# Altium schematic sheet LTC2194_3.SchDoc
size A; SheetNumber: 8; SheetTotal: 24
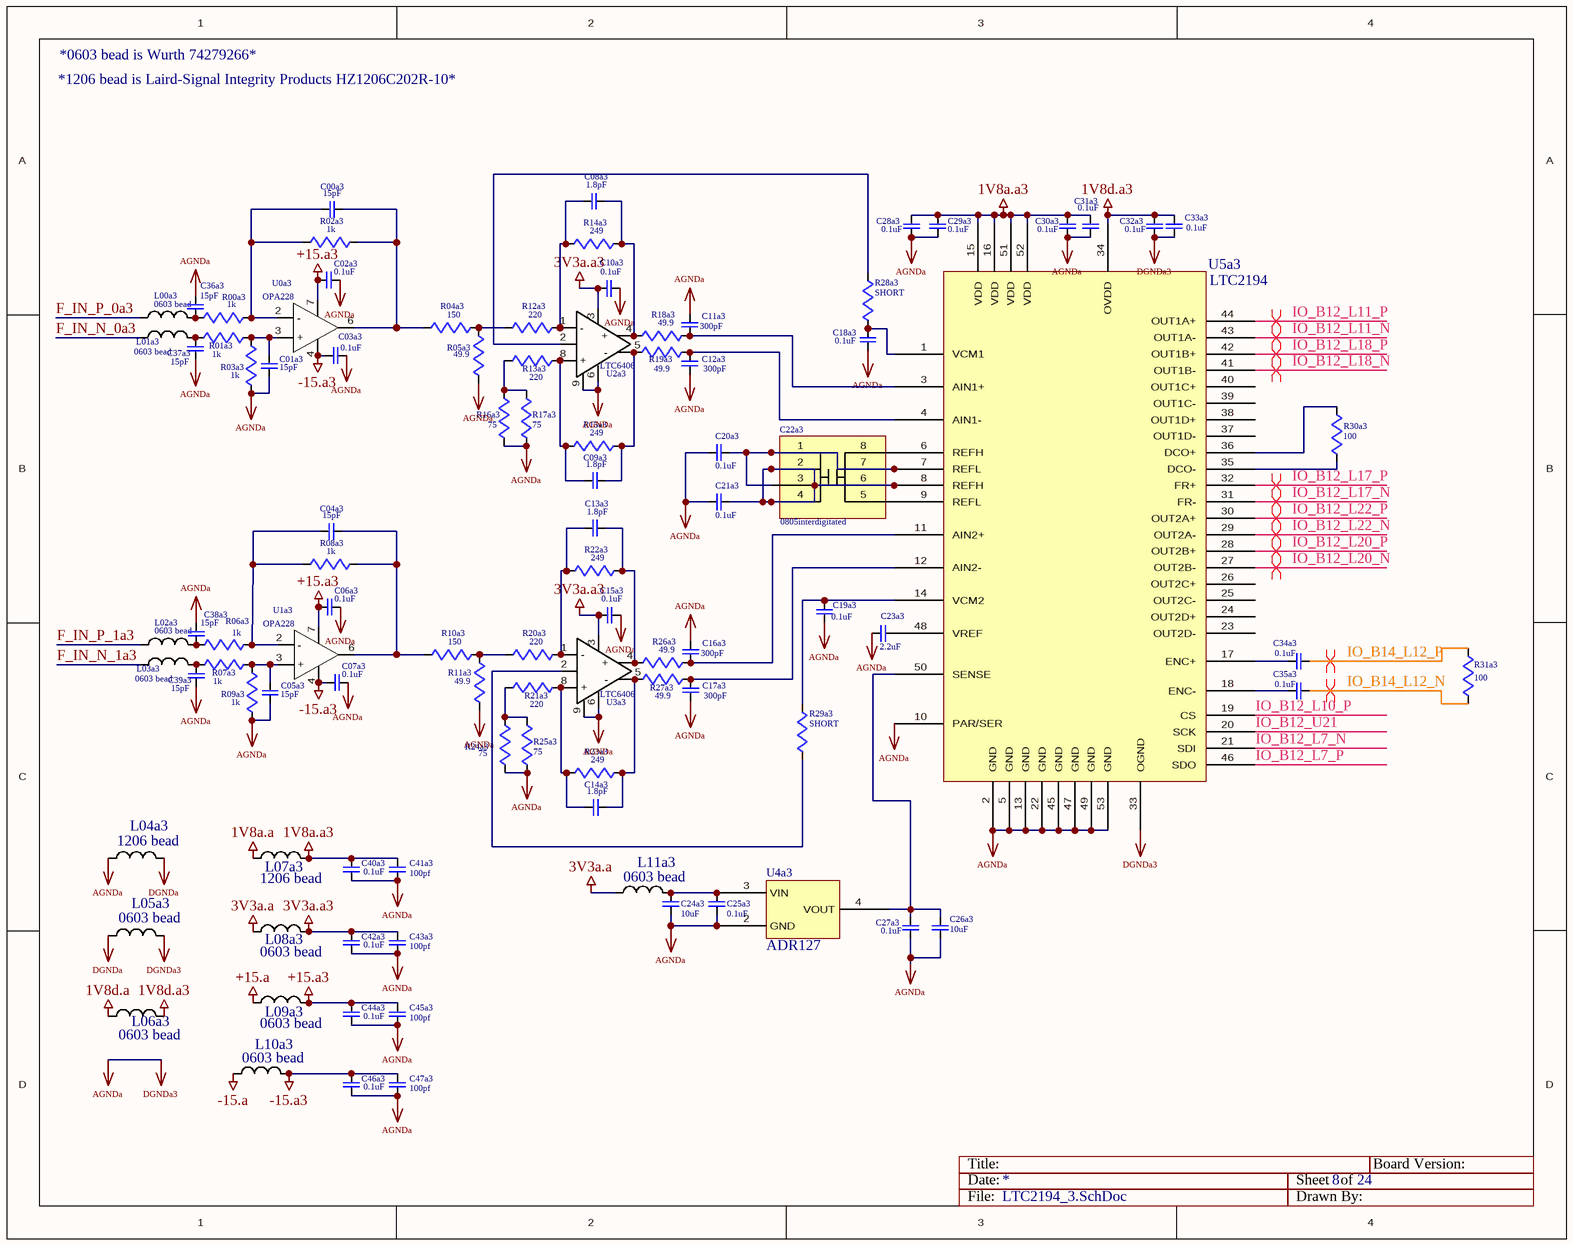
[diagram p0: LTC2194_3.SchDoc]

## Parts
C00a3  15pF  [0603]
C01a3  15pF  [0603]
C02a3  0.1uF  [0603]
C03a3  0.1uF  [0603]
C04a3  15pF  [0603]
C05a3  15pF  [0603]
C06a3  0.1uF  [0603]
C07a3  0.1uF  [0603]
C08a3  1.8pF  [0603]
C09a3  1.8pF  [0603]
C10a3  0.1uF  [0603]
C11a3  300pF  [0603]
C12a3  300pF  [0603]
C13a3  1.8pF  [0603]
C14a3  1.8pF  [0603]
C15a3  0.1uF  [0603]
C16a3  300pF  [0603]
C17a3  300pF  [0603]
C18a3  0.1uF  [0402]
C19a3  0.1uF  [0402]
C20a3  0.1uF  [0402]
C21a3  0.1uF  [0402]
C22a3  0805interdigitated  [0805int]
C23a3  2.2uF  [0402]
C24a3  10uF  [0603]
C25a3  0.1uF  [0603]
C26a3  10uF  [0603]
C27a3  0.1uF  [0603]
C28a3  0.1uF  [0402]
C29a3  0.1uF  [0402]
C30a3  0.1uF  [0402]
C31a3  0.1uF  [0402]
C32a3  0.1uF  [0402]
C33a3  0.1uF  [0402]
C34a3  0.1uF  [0402]
C35a3  0.1uF  [0402]
C36a3  15pF  [0603]
C37a3  15pF  [0603]
C38a3  15pF  [0603]
C39a3  15pF  [0603]
C40a3  0.1uF  [0603]
C41a3  100pf  [0603]
C42a3  0.1uF  [0603]
C43a3  100pf  [0603]
C44a3  0.1uF  [0603]
C45a3  100pf  [0603]
C46a3  0.1uF  [0603]
C47a3  100pf  [0603]
L00a3  0603 bead  [0603]
L01a3  0603 bead  [0603]
L02a3  0603 bead  [0603]
L03a3  0603 bead  [0603]
L04a3  1206 bead  [1206]
L05a3  0603 bead  [0603]
L06a3  0603 bead  [0603]
L07a3  1206 bead  [1206]
L08a3  0603 bead  [0603]
L09a3  0603 bead  [0603]
L10a3  0603 bead  [0603]
L11a3  0603 bead  [0603]
R00a3  1k  [0603]
R01a3  1k  [0603]
R02a3  1k  [0603]
R03a3  1k  [0603]
R04a3  150  [0603]
R05a3  49.9  [0603]
R06a3  1k  [0603]
R07a3  1k  [0603]
R08a3  1k  [0603]
R09a3  1k  [0603]
R10a3  150  [0603]
R11a3  49.9  [0603]
R12a3  220  [0603]
R13a3  220  [0603]
R14a3  249  [0603]
R15a3  249  [0603]
R16a3  75  [0603]
R17a3  75  [0603]
R18a3  49.9  [0603]
R19a3  49.9  [0603]
R20a3  220  [0603]
R21a3  220  [0603]
R22a3  249  [0603]
R23a3  249  [0603]
R24a3  75  [0603]
R25a3  75  [0603]
R26a3  49.9  [0603]
R27a3  49.9  [0603]
R28a3  SHORT  [0603]
R29a3  SHORT  [0603]
R30a3  100  [0603]
R31a3  100  [0402]
U0a3  OPA228  [8SOIC]
U1a3  OPA228  [8SOIC]
U2a3  LTC6406  [8MSOP]
U3a3  LTC6406  [8MSOP]
U4a3  ADR127  [6TSOT]
U5a3  LTC2194  [52QFN]

## Nets
1V8a.a: L07a3.1
1V8a.a3: C28a3.1 C29a3.1 C30a3.1 C31a3.1 C40a3.1 C41a3.1 L07a3.2 U5a3.15(VDD) U5a3.16(VDD) U5a3.51(VDD) U5a3.52(VDD)
1V8d.a: L06a3.1
1V8d.a3: C32a3.1 C33a3.2 L06a3.2 U5a3.34(OVDD)
3V3a.a: L08a3.1 L11a3.1
3V3a.a3: C10a3.1 C15a3.1 C42a3.1 C43a3.1 L08a3.2 U2a3.3(V+) U3a3.3(V+)
+15.a: L09a3.1
+15.a3: C02a3.2 C06a3.2 C44a3.1 C45a3.1 L09a3.2 U0a3.7(V+) U1a3.7(V+)
-15.a: L10a3.1
-15.a3: C03a3.2 C07a3.2 C46a3.1 C47a3.1 L10a3.2 U0a3.4(V-) U1a3.4(V-)
AGNDa: C01a3.2 C02a3.1 C03a3.1 C05a3.2 C06a3.1 C07a3.1 C10a3.2 C11a3.2 C12a3.1 C15a3.2 C16a3.2 C17a3.1 C18a3.1 C19a3.1 C20a3.2 C21a3.2 C23a3.2 C24a3.2 C25a3.2 C26a3.2 C27a3.2 C28a3.2 C29a3.2 C30a3.2 C31a3.2 C32a3.2 C33a3.1 C36a3.1 C37a3.2 C38a3.1 C39a3.2 C40a3.2 C41a3.2 C42a3.2 C43a3.2 C44a3.2 C45a3.2 C46a3.2 C47a3.2 L04a3.1 L05a3.2 R03a3.1 R05a3.2 R09a3.1 R11a3.2 R16a3.2 R17a3.2 R24a3.2 R25a3.2 U2a3.6(V-) U2a3.9(V-) U3a3.6(V-) U3a3.9(V-) U4a3.2(GND) U5a3.2(GND) U5a3.5(GND) U5a3.10(PAR/SER) U5a3.13(GND) U5a3.22(GND) U5a3.33(OGND) U5a3.45(GND) U5a3.47(GND) U5a3.49(GND) U5a3.53(GND)  [also labelled DGNDa3]
DGNDa: L04a3.2 L05a3.1
F_IN_N_0a3: L01a3.1
F_IN_N_1a3: L03a3.1
F_IN_P_0a3: L00a3.1
F_IN_P_1a3: L02a3.1
IO_B12_L7_N: U5a3.21(SDI)
IO_B12_L7_P: U5a3.46(SDO)
IO_B12_L10_P: U5a3.19(CS)
IO_B12_L11_N: U5a3.43(OUT1A-)
IO_B12_L11_P: U5a3.44(OUT1A+)
IO_B12_L17_N: U5a3.31(FR-)
IO_B12_L17_P: U5a3.32(FR+)
IO_B12_L18_N: U5a3.41(OUT1B-)
IO_B12_L18_P: U5a3.42(OUT1B+)
IO_B12_L20_N: U5a3.27(OUT2B-)
IO_B12_L20_P: U5a3.28(OUT2B+)
IO_B12_L22_N: U5a3.29(OUT2A-)
IO_B12_L22_P: U5a3.30(OUT2A+)
IO_B12_U21: U5a3.20(SCK)
IO_B14_L12_N: C35a3.1 R31a3.2
IO_B14_L12_P: C34a3.1 R31a3.1
NetC00a3_1: C00a3.1 R00a3.1 R02a3.2 U0a3.2(-)
NetC00a3_2: C00a3.2 R02a3.1 R04a3.2 U0a3.6(OUT)
NetC01a3_1: C01a3.1 R01a3.1 R03a3.2 U0a3.3(+)
NetC04a3_1: C04a3.1 R06a3.1 R08a3.2 U1a3.2(-)
NetC04a3_2: C04a3.2 R08a3.1 R10a3.2 U1a3.6(OUT)
NetC05a3_1: C05a3.1 R07a3.1 R09a3.2 U1a3.3(+)
NetC08a3_1: C08a3.1 R12a3.1 R14a3.2 U2a3.1(-)
NetC08a3_2: C08a3.2 R14a3.1 R18a3.2 U2a3.4(+)
NetC09a3_1: C09a3.1 R13a3.1 R15a3.2 U2a3.8(+)
NetC09a3_2: C09a3.2 R15a3.1 R19a3.2 U2a3.5(-)
NetC11a3_1: C11a3.1 R18a3.1 U5a3.3(AIN1+)
NetC12a3_2: C12a3.2 R19a3.1 U5a3.4(AIN1-)
NetC13a3_1: C13a3.1 R20a3.1 R22a3.2 U3a3.1(-)
NetC13a3_2: C13a3.2 R22a3.1 R26a3.2 U3a3.4(+)
NetC14a3_1: C14a3.1 R21a3.1 R23a3.2 U3a3.8(+)
NetC14a3_2: C14a3.2 R23a3.1 R27a3.2 U3a3.5(-)
NetC16a3_1: C16a3.1 R26a3.1 U5a3.11(AIN2+)
NetC17a3_2: C17a3.2 R27a3.1 U5a3.12(AIN2-)
NetC18a3_2: C18a3.2 R28a3.2 U5a3.1(VCM1)
NetC19a3_2: C19a3.2 R29a3.1 U5a3.14(VCM2)
NetC20a3_1: C20a3.1 C22a3.1 C22a3.3 C22a3.7 U5a3.7(REFL)
NetC21a3_1: C21a3.1 C22a3.2 C22a3.4 C22a3.6 U5a3.8(REFH)
NetC22a3_5: C22a3.5 U5a3.9(REFL)
NetC22a3_8: C22a3.8 U5a3.6(REFH)
NetC23a3_1: C23a3.1 U5a3.48(VREF)
NetC24a3_1: C24a3.1 C25a3.1 L11a3.2 U4a3.3(VIN)
NetC26a3_1: C26a3.1 C27a3.1 U4a3.4(VOUT) U5a3.50(SENSE)
NetC34a3_2: C34a3.2 U5a3.17(ENC+)
NetC35a3_2: C35a3.2 U5a3.18(ENC-)
NetC36a3_2: C36a3.2 L00a3.2 R00a3.2
NetC37a3_1: C37a3.1 L01a3.2 R01a3.2
NetC38a3_2: C38a3.2 L02a3.2 R06a3.2
NetC39a3_1: C39a3.1 L03a3.2 R07a3.2
NetR04a3_1: R04a3.1 R05a3.1 R12a3.2
NetR10a3_1: R10a3.1 R11a3.1 R20a3.2
NetR13a3_2: R13a3.2 R16a3.1 R17a3.1
NetR21a3_2: R21a3.2 R24a3.1 R25a3.1
NetR28a3_1: R28a3.1 U2a3.2(VOCM)
NetR29a3_2: R29a3.2 U3a3.2(VOCM)
NetR30a3_1: R30a3.1 U5a3.36(DCO+)
NetR30a3_2: R30a3.2 U5a3.35(DCO-)

Not connected (* = marked no-connect by the designer): U5a3 23(OUT2D-) 24(OUT2D+) 25(OUT2C-) 26(OUT2C+) 37(OUT1D-) 38(OUT1D+) 39(OUT1C-) 40(OUT1C+)

## Layout directives
differential pair: IO_B12_L11_N, IO_B12_L11_P, IO_B12_L17_N, IO_B12_L17_P, IO_B12_L18_N, IO_B12_L18_P, IO_B12_L20_N, IO_B12_L20_P, IO_B12_L22_N, IO_B12_L22_P, IO_B14_L12_N, IO_B14_L12_P

## Notes on the sheet
- *1206 bead is Laird-Signal Integrity Products HZ1206C202R-10*
- *0603 bead is Wurth 74279266*
- Title:
- Date:
- Sheet
- of
- Board Version:
- File:
- Drawn By:

## Library data of the parts
C00a3 C01a3 C02a3 C03a3 C04a3 C05a3 C06a3 C07a3 C08a3 C09a3 C10a3 C11a3 C12a3 C13a3 C14a3 C15a3 C16a3 C17a3 C18a3 C19a3 C20a3 C21a3 C23a3 C24a3 C25a3 C26a3 C27a3 C28a3 C29a3 C30a3 C31a3 C32a3 C33a3 C34a3 C35a3 C36a3 C37a3 C38a3 C39a3 C40a3 C41a3 C42a3 C43a3 C44a3 C45a3 C46a3 C47a3 = CAP
C22a3 = 0805intCap
L00a3 L01a3 L02a3 L03a3 L04a3 L05a3 L06a3 L07a3 L08a3 L09a3 L10a3 L11a3 = INDUCTOR
R00a3 R01a3 R02a3 R03a3 R04a3 R05a3 R06a3 R07a3 R08a3 R09a3 R10a3 R11a3 R12a3 R13a3 R14a3 R15a3 R16a3 R17a3 R18a3 R19a3 R20a3 R21a3 R22a3 R23a3 R24a3 R25a3 R26a3 R27a3 R28a3 R29a3 R30a3 R31a3 = RES
U0a3 U1a3 = LF356
U4a3 = ADR12x